# Altium schematic sheet OptoComp.SchDoc
size A4; SheetNumber: 1; SheetTotal: 1
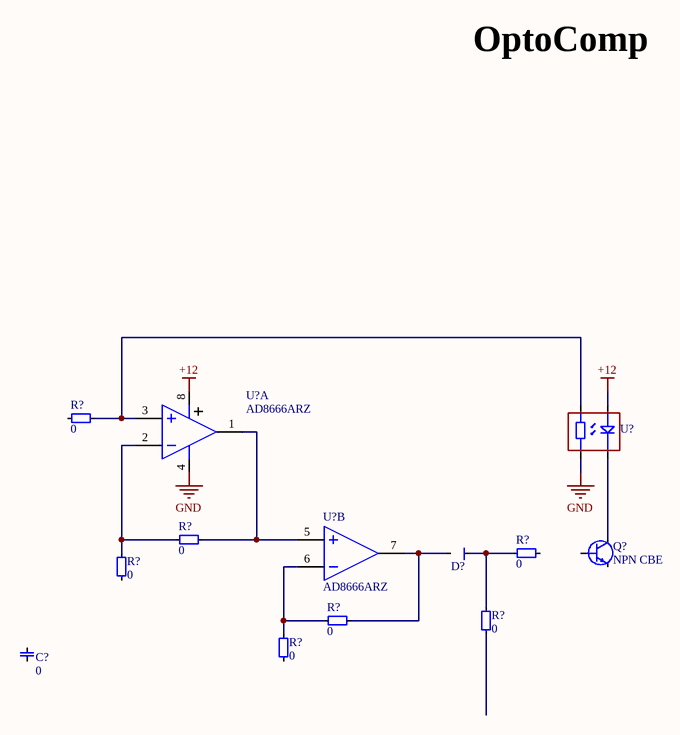
[diagram p0: OptoComp.SchDoc]

## Parts
(Parts that share a designator on the sheet are numbered #1, #2 ... from top to bottom, then left to right.)
C?  value 0  [0805, cap]  (hidden comment: 0805, capacitor)
D?  Diode, TH  [TO-220-F2]  (value not drawn)
Q?  NPN CBE  [BC547_TO-92_BENT]
R?#1  value 0  [0805]  (hidden comment: General resistor)
R?#2  value 0  [0805]  (hidden comment: General resistor)
R?#3  value 0  [0805]  (hidden comment: General resistor)
R?#4  value 0  [0805]  (hidden comment: General resistor)
R?#5  value 0  [0805]  (hidden comment: General resistor)
R?#6  value 0  [0805]  (hidden comment: General resistor)
R?#7  value 0  [0805]  (hidden comment: General resistor)
U?#1  AD8666ARZ  [SOIC8]  (part A of 2)
U?#2  Optocoupler  [Optocoupler LED+LDR]  (value not drawn)
U?#3  AD8666ARZ  [SOIC8]  (part B of 2)

## Nets
+12: U?#1.8(V+) U?#2.A
GND: U?#1.4(V-) U?#2.4
NetD?_1: D?.1 R?#3.0 R?#6.0
NetD?_2: D?.2 R?#5.0 U?#3.7(OUT)
NetQ?_1: Q?.1(C) U?#2.K
NetR?#1_0: R?#1.0 U?#1.3(IN+) U?#2.3
NetR?#2_0: R?#2.0 U?#1.1(OUT) U?#3.5(IN+)
NetR?#2_1: R?#2.1 R?#4.0 U?#1.2(IN-)
NetR?#5_1: R?#5.1 R?#7.0 U?#3.6(IN-)

Not connected (* = marked no-connect by the designer): C? 1 2; Q? 2(B) 3(E); R?#1 1; R?#3 1; R?#4 1; R?#6 1; R?#7 1

## Notes on the sheet
- OptoComp
- TITLE:
- REV:
- DOCUMENT:
- noxet
- DATE:

## Library data of the parts
R?#1-R?#7 = resistor
U?#1 U?#3 = AD8666ARZ: Operational Amplifier, 2 Func, 5000uV Offset-Max, CMOS, PDSO8; Manufacturer: Analog Devices; Package Body Material: Plastic; Architecture: VOLTAGE-FEEDBACK; Average Bias Current-Max (IIB): 550pA; Bias Current-Max (IIB) @25C: 1pA; Common-mode Reject Ratio-Nom: 100dB; Frequency Compensation: YES; Input Offset Voltage-Max: 5mV; Low-Offset: No; Neg Supply Voltage Limit-Max: 0V; Channels: 2; Package Equivalence Code: SOP8,.25; Power Supplies: +-2.5/+-8/5/16V; Slew Rate: 3.5V/µs; Max Supply Current: 4mA; Supply Voltage Limit-Max: 18V; Nominal Supply Voltage: 5V; Time @ Peak Reflow Temperature-Max (s): 30s; Unity Gain BW-Nom: 4MHz; Voltage Gain-Min: 68000; Qualification Status: Not Qualified; Supplier: Mouser; Supplier Part Number: 584-AD8666ARZ; Manufacturer Part Number: AD8666ARZ; RoHS: Yes; Category: Amplifiers - Op Amps, Buffer, Instrumentation; Stock: 1754; Pricing: 1=2,83, 10=1,96, 50=1,96, 100=1,63, 1000=1,63, 10000=1,63 (USD); Case/Package: SOP; Pins: 8; Package Shape: Rectangular; Terminal Finish: Tin; Min Operating Temperature: -40°C; Max Operating Temperature: 125°C; JESD-609 Code: e3; Amplifier Type: OPERATIONAL AMPLIFIER; JESD-30 Code: R-PDSO-G8; Low-Bias: Yes; Micropower: No; Moisture Sensitivity Level: 1; Neg Supply Voltage-Nom (Vsup): 0V; Package Style: SMALL OUTLINEMeter; Peak Reflow Temperature (Cel): 260°C; Power: No; Programmable Power: No; Surface Mount: Yes; Technology: CMOS; Terminal Form: Gull Wing; Terminal Position: DUAL; Wideband: No; Length: 4.9mm; Width: 3.9mm; Height - Seated (Max): 1.75mm; Terminal Pitch: 1.27mm; Temperature Grade: AUTOMOTIVE; Reach SVHC Compliant: Yes; RoHS Compliant: Yes; ComponentLink1URL: https://datasheet.ciiva.com:443/pdfs/VipMasterIC/IC/ANDI/ANDIS11402/ANDIS11402-1.pdf?src-supplier=IHS+Markit; ComponentLink1Description: https://datasheet.ciiva.com:443/pdfs/VipMasterIC/IC/ANDI/ANDIS11402/ANDIS11402-1.pdf?src-supplier=IHS+Markit; ComponentLink2URL: https://datasheet.ciiva.com/1487/1481546-1487312.pdf?src-supplier=Element14; ComponentLink2Description: https://datasheet.ciiva.com/1487/1481546-1487312.pdf?src-supplier=Element14; ComponentLink3URL: https://datasheet.ciiva.com/2974/ad8665-ad8666-ad8668-2974734.pdf?src-supplier=Avnet; ComponentLink3Description: https://datasheet.ciiva.com/2974/ad8665-ad8666-ad8668-2974734.pdf?src-supplier=Avnet; ComponentLink4URL: https://datasheet.ciiva.com/1794/ad8665-ad8666-ad8668-1794389.pdf?src-supplier=Digikey; ComponentLink4Description: https://datasheet.ciiva.com/1794/ad8665-ad8666-ad8668-1794389.pdf?src-supplier=Digikey; ComponentLink5URL: https://datasheet.ciiva.com/48705/001249492-da-01-en-ic-opamp-gp-r-r-4mh-ad8666arz-soic-8-adi-48705820.pdf?src-supplier=Conrad; ComponentLink5Description: https://datasheet.ciiva.com/48705/001249492-da-01-en-ic-opamp-gp-r-r-4mh-ad8666arz-soic-8-adi-48705820.pdf?src-supplier=Conrad
U?#2 = Optocoupler LED+LDR